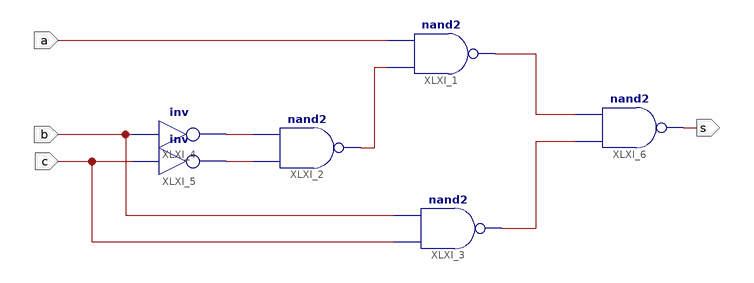
[diagram p0: schematic sheet 1]
// Xilinx ISE schematic circuit1.sch (spartan3e) as structural Verilog: 6 symbols, 4 ports
module circuit1 (
  input  a,
  input  b,
  input  c,
  output s
);

  wire XLXN_2, XLXN_3, XLXN_4, XLXN_6, XLXN_7;

  nand XLXI_1 (XLXN_6, XLXN_4, a);
  nand XLXI_2 (XLXN_4, XLXN_3, XLXN_2);
  nand XLXI_3 (XLXN_7, c, b);
  not XLXI_4 (XLXN_2, b);
  not XLXI_5 (XLXN_3, c);
  nand XLXI_6 (s, XLXN_7, XLXN_6);
endmodule
